# Altium schematic sheet Sheet.SchDoc
size A4
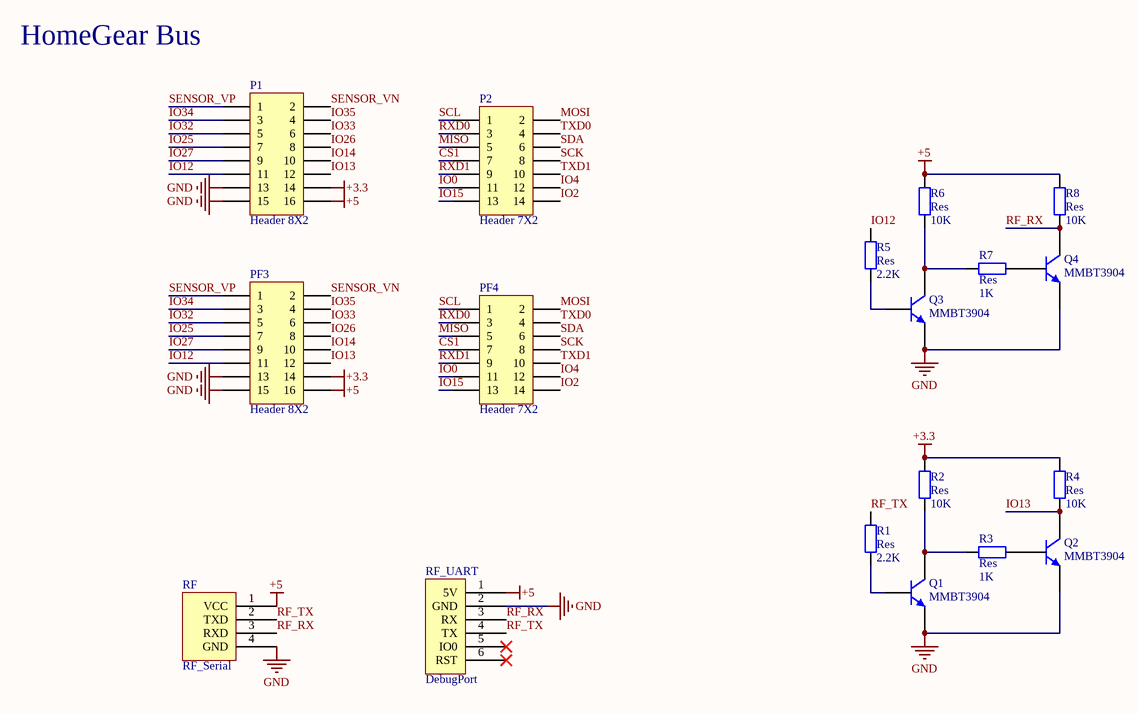
[diagram p0: Sheet.SchDoc]

## Parts
P1  Header 8X2  [SMD_PIN_HDR8x2_2.0MM]
P2  Header 7X2  [SMD_PIN_HDR7x2_2.0MM]
PF3  Header 8X2  [SMD_FEM_HDR8x2_2.0MM]
PF4  Header 7X2  [SMD_FEM_HDR7x2_2.0MM]
Q1  MMBT3904  [SOT-23B_N]
Q2  MMBT3904  [SOT-23B_N]
Q3  MMBT3904  [SOT-23B_N]
Q4  MMBT3904  [SOT-23B_N]
R1  Res  value 2.2K  [My0603]
R2  Res  value 10K  [My0603]
R3  Res  value 1K  [My0603]
R4  Res  value 10K  [My0603]
R5  Res  value 2.2K  [My0603]
R6  Res  value 10K  [My0603]
R7  Res  value 1K  [My0603]
R8  Res  value 10K  [My0603]
RF  RF_Serial  [Serial_RF_Module]
RF_UART  DebugPort  [XH2.54-WI-6P]

## Nets
+3.3: P1.14 PF3.14 R2.1 R4.1
+5: P1.16 PF3.16 R6.1 R8.1 RF.1(VCC) RF_UART.1(5V)
GND: P1.13 P1.15 PF3.13 PF3.15 Q1.2(E) Q2.2(E) Q3.2(E) Q4.2(E) RF.4(GND) RF_UART.2(GND)
CS1: P2.7 PF4.7
IO0: P2.11 PF4.11
IO2: P2.14 PF4.14
IO4: P2.12 PF4.12
IO12: P1.11 PF3.11 R5.1
IO13: P1.12 PF3.12 Q2.3(C) R4.2
IO14: P1.10 PF3.10
IO15: P2.13 PF4.13
IO25: P1.7 PF3.7
IO26: P1.8 PF3.8
IO27: P1.9 PF3.9
IO32: P1.5 PF3.5
IO33: P1.6 PF3.6
IO34: P1.3 PF3.3
IO35: P1.4 PF3.4
MISO: P2.5 PF4.5
MOSI: P2.2 PF4.2
RF_RX: Q4.3(C) R8.2 RF.3(RXD) RF_UART.3(RX)
RF_TX: R1.1 RF.2(TXD) RF_UART.4(TX)
RXD0: P2.3 PF4.3
RXD1: P2.9 PF4.9
SCK: P2.8 PF4.8
SCL: P2.1 PF4.1
SDA: P2.6 PF4.6
SENSOR_VN: P1.2 PF3.2
SENSOR_VP: P1.1 PF3.1
TXD0: P2.4 PF4.4
TXD1: P2.10 PF4.10
NetQ1_1: Q1.1(B) R1.2
NetQ1_3: Q1.3(C) R2.2 R3.2
NetQ2_1: Q2.1(B) R3.1
NetQ3_1: Q3.1(B) R5.2
NetQ3_3: Q3.3(C) R6.2 R7.2
NetQ4_1: Q4.1(B) R7.1

Not connected (* = marked no-connect by the designer): RF_UART 5(IO0)* 6(RST)*

## Notes on the sheet
- HomeGear Bus

## Library data of the parts
P1 PF3 = Header 8X2: Header, 8-Pin, Dual row; LatestRevisionDate: 17-Jul-2002; LatestRevisionNote: Re-released for DXP Platform.; Publisher: Altium Limited
P2 PF4 = Header 7X2: Header, 7-Pin, Dual row; LatestRevisionDate: 17-Jul-2002; LatestRevisionNote: Re-released for DXP Platform.; Publisher: Altium Limited
R1-R8 = Res2: Resistor; Published: 8-Jun-2000; LatestRevisionDate: 17-Jul-2002; LatestRevisionNote: Re-released for DXP Platform.; PackageReference: AXIAL-0.4; Publisher: Altium Limited; PackageDescription: Axial Device, Thru-Hole; 2 Leads; 0.4 in Pin Spacing